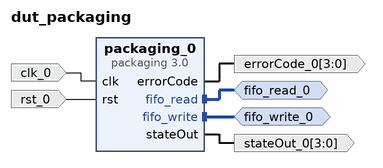
[diagram p0: block diagram of the top level]
# Vivado block design dut_packaging, xc7a100tcsg324-1, Vivado 2018.3
create_bd_design dut_packaging

create_bd_intf_port -mode Master -vlnv xilinx.com:interface:fifo_write_rtl:1.0 fifo_write_0
create_bd_intf_port -mode Master -vlnv xilinx.com:interface:fifo_read_rtl:1.0 fifo_read_0
create_bd_port -dir O -from 3 -to 0 errorCode_0
create_bd_port -dir I -type clk clk_0
create_bd_port -dir I -type rst rst_0
create_bd_port -dir O -from 3 -to 0 stateOut_0

create_bd_cell -type ip -vlnv user.org:user:packaging:3.0 packaging_0

# ---- connections ----

connect_bd_intf_net [get_bd_intf_ports fifo_read_0] [get_bd_intf_pins packaging_0/fifo_read]
connect_bd_intf_net [get_bd_intf_ports fifo_write_0] [get_bd_intf_pins packaging_0/fifo_write]
connect_bd_net [get_bd_pins packaging_0/errorCode] [get_bd_ports errorCode_0]
connect_bd_net -net clk_0_1 [get_bd_ports clk_0] [get_bd_pins packaging_0/clk]
connect_bd_net -net rst_0_1 [get_bd_ports rst_0] [get_bd_pins packaging_0/rst]
connect_bd_net [get_bd_pins packaging_0/stateOut] [get_bd_ports stateOut_0]

validate_bd_design
save_bd_design
